# Altium schematic sheet Balancing.SchDoc
size A4; SheetNumber: 5; SheetTotal: 5
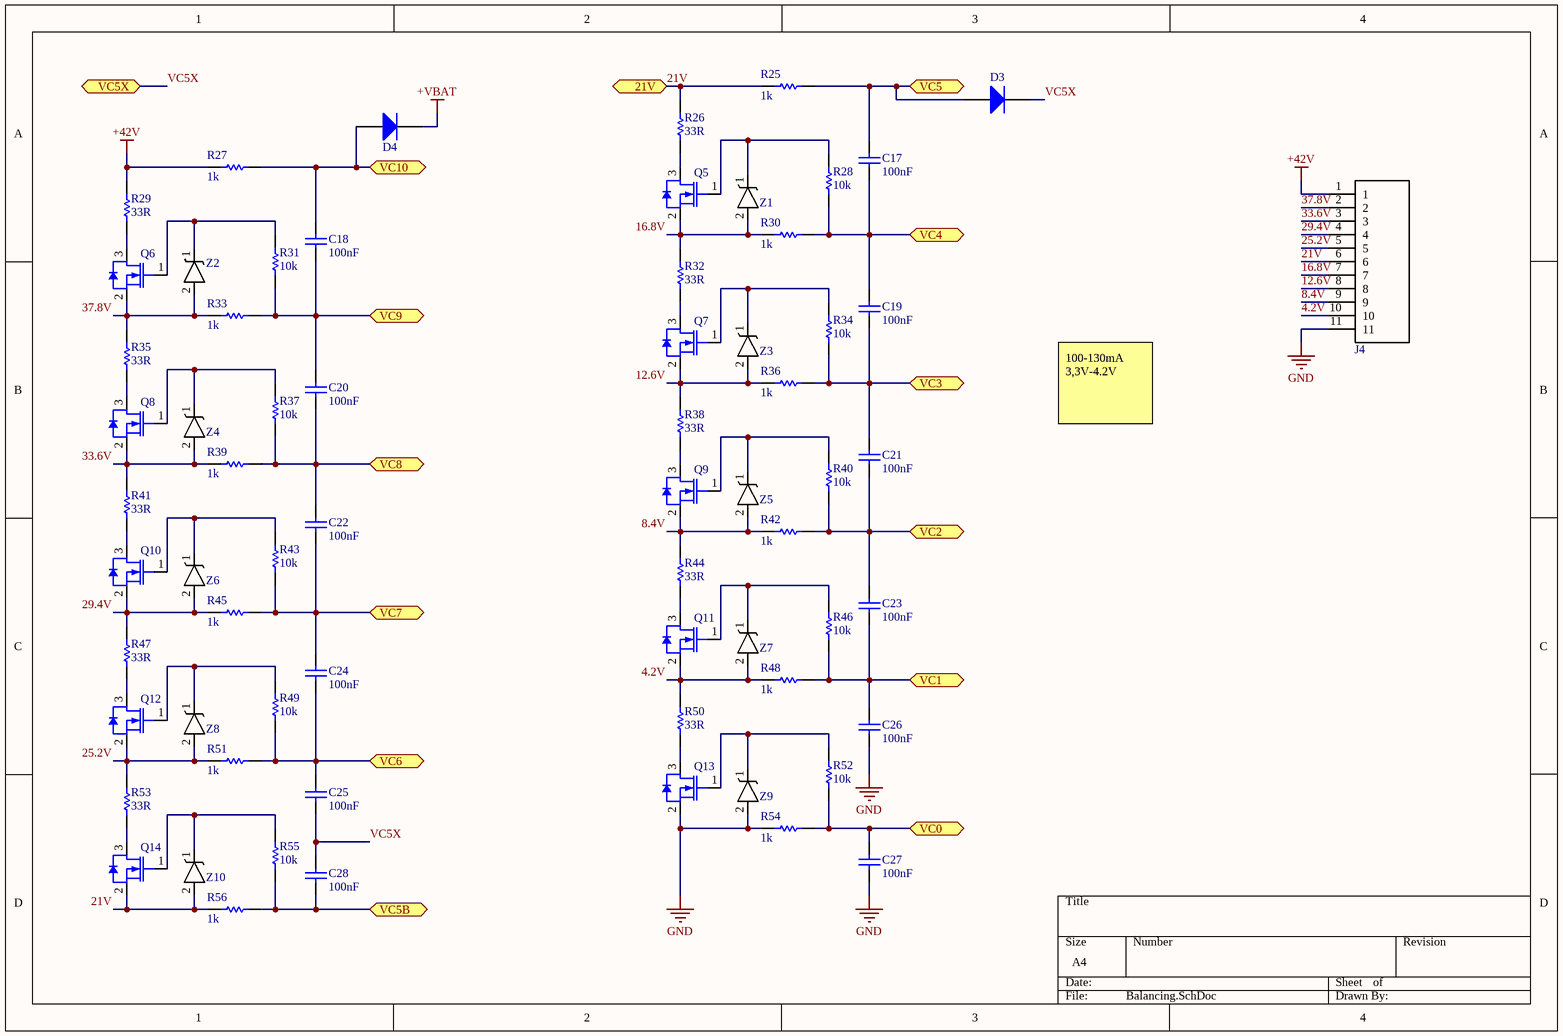
[diagram p0: Balancing.SchDoc]

## Parts
C17  value 100nF  [Wurth 0603 capacitor]  (hidden comment: Generic Capacitor 100nF 0603)
C18  value 100nF  [Wurth 0603 capacitor]  (hidden comment: Generic Capacitor 100nF 0603)
C19  value 100nF  [Wurth 0603 capacitor]  (hidden comment: Generic Capacitor 100nF 0603)
C20  value 100nF  [Wurth 0603 capacitor]  (hidden comment: Generic Capacitor 100nF 0603)
C21  value 100nF  [Wurth 0603 capacitor]  (hidden comment: Generic Capacitor 100nF 0603)
C22  value 100nF  [Wurth 0603 capacitor]  (hidden comment: Generic Capacitor 100nF 0603)
C23  value 100nF  [Wurth 0603 capacitor]  (hidden comment: Generic Capacitor 100nF 0603)
C24  value 100nF  [Wurth 0603 capacitor]  (hidden comment: Generic Capacitor 100nF 0603)
C25  value 100nF  [Wurth 0603 capacitor]  (hidden comment: Generic Capacitor 100nF 0603)
C26  value 100nF  [Wurth 0603 capacitor]  (hidden comment: Generic Capacitor 100nF 0603)
C27  value 100nF  [Wurth 0603 capacitor]  (hidden comment: Generic Capacitor 100nF 0603)
C28  value 100nF  [Wurth 0603 capacitor]  (hidden comment: Generic Capacitor 100nF 0603)
D3  1N4148W-7-F  [DIOD-SOD123-2_V]  (value not drawn)
D4  1N4148W-7-F  [DIOD-SOD123-2_V]  (value not drawn)
J4  S11B-PH-K-S_LF__SN_  [S11BPHKSLFSN]  (value not drawn)
Q5  DMN2004K-7  [Diodes SOT23-3]  (value not drawn)
Q6  DMN2004K-7  [Diodes SOT23-3]  (value not drawn)
Q7  DMN2004K-7  [Diodes SOT23-3]  (value not drawn)
Q8  DMN2004K-7  [Diodes SOT23-3]  (value not drawn)
Q9  DMN2004K-7  [Diodes SOT23-3]  (value not drawn)
Q10  DMN2004K-7  [Diodes SOT23-3]  (value not drawn)
Q11  DMN2004K-7  [Diodes SOT23-3]  (value not drawn)
Q12  DMN2004K-7  [Diodes SOT23-3]  (value not drawn)
Q13  DMN2004K-7  [Diodes SOT23-3]  (value not drawn)
Q14  DMN2004K-7  [Diodes SOT23-3]  (value not drawn)
R25  value 1k  [Wurth 0603 Resistor]  (hidden comment: CRCW060310K0FKEA)
R26  value 33R  [FOJAN 2010 Resistor]  (hidden comment: FRC2010F33R0TS)
R27  value 1k  [Wurth 0603 Resistor]  (hidden comment: CRCW060310K0FKEA)
R28  value 10k  [Wurth 0603 Resistor]  (hidden comment: Generic Resistor 10k 0603)
R29  value 33R  [FOJAN 2010 Resistor]  (hidden comment: FRC2010F33R0TS)
R30  value 1k  [Wurth 0603 Resistor]  (hidden comment: CRCW060310K0FKEA)
R31  value 10k  [Wurth 0603 Resistor]  (hidden comment: Generic Resistor 10k 0603)
R32  value 33R  [FOJAN 2010 Resistor]  (hidden comment: FRC2010F33R0TS)
R33  value 1k  [Wurth 0603 Resistor]  (hidden comment: CRCW060310K0FKEA)
R34  value 10k  [Wurth 0603 Resistor]  (hidden comment: Generic Resistor 10k 0603)
R35  value 33R  [FOJAN 2010 Resistor]  (hidden comment: FRC2010F33R0TS)
R36  value 1k  [Wurth 0603 Resistor]  (hidden comment: CRCW060310K0FKEA)
R37  value 10k  [Wurth 0603 Resistor]  (hidden comment: Generic Resistor 10k 0603)
R38  value 33R  [FOJAN 2010 Resistor]  (hidden comment: FRC2010F33R0TS)
R39  value 1k  [Wurth 0603 Resistor]  (hidden comment: CRCW060310K0FKEA)
R40  value 10k  [Wurth 0603 Resistor]  (hidden comment: Generic Resistor 10k 0603)
R41  value 33R  [FOJAN 2010 Resistor]  (hidden comment: FRC2010F33R0TS)
R42  value 1k  [Wurth 0603 Resistor]  (hidden comment: CRCW060310K0FKEA)
R43  value 10k  [Wurth 0603 Resistor]  (hidden comment: Generic Resistor 10k 0603)
R44  value 33R  [FOJAN 2010 Resistor]  (hidden comment: FRC2010F33R0TS)
R45  value 1k  [Wurth 0603 Resistor]  (hidden comment: CRCW060310K0FKEA)
R46  value 10k  [Wurth 0603 Resistor]  (hidden comment: Generic Resistor 10k 0603)
R47  value 33R  [FOJAN 2010 Resistor]  (hidden comment: FRC2010F33R0TS)
R48  value 1k  [Wurth 0603 Resistor]  (hidden comment: CRCW060310K0FKEA)
R49  value 10k  [Wurth 0603 Resistor]  (hidden comment: Generic Resistor 10k 0603)
R50  value 33R  [FOJAN 2010 Resistor]  (hidden comment: FRC2010F33R0TS)
R51  value 1k  [Wurth 0603 Resistor]  (hidden comment: CRCW060310K0FKEA)
R52  value 10k  [Wurth 0603 Resistor]  (hidden comment: Generic Resistor 10k 0603)
R53  value 33R  [FOJAN 2010 Resistor]  (hidden comment: FRC2010F33R0TS)
R54  value 1k  [Wurth 0603 Resistor]  (hidden comment: CRCW060310K0FKEA)
R55  value 10k  [Wurth 0603 Resistor]  (hidden comment: Generic Resistor 10k 0603)
R56  value 1k  [Wurth 0603 Resistor]  (hidden comment: CRCW060310K0FKEA)
Z1  MMSZ5232BS-7-F  [Diodes SOD-323]  (value not drawn)
Z2  MMSZ5232BS-7-F  [Diodes SOD-323]  (value not drawn)
Z3  MMSZ5232BS-7-F  [Diodes SOD-323]  (value not drawn)
Z4  MMSZ5232BS-7-F  [Diodes SOD-323]  (value not drawn)
Z5  MMSZ5232BS-7-F  [Diodes SOD-323]  (value not drawn)
Z6  MMSZ5232BS-7-F  [Diodes SOD-323]  (value not drawn)
Z7  MMSZ5232BS-7-F  [Diodes SOD-323]  (value not drawn)
Z8  MMSZ5232BS-7-F  [Diodes SOD-323]  (value not drawn)
Z9  MMSZ5232BS-7-F  [Diodes SOD-323]  (value not drawn)
Z10  MMSZ5232BS-7-F  [Diodes SOD-323]  (value not drawn)

## Ports
21V (bidir), VC0 (bidir), VC1 (bidir), VC2 (bidir), VC3 (bidir), VC4 (bidir), VC5 (bidir), VC5B (bidir), VC5X (bidir), VC6 (bidir), VC7 (bidir), VC8 (bidir), VC9 (bidir), VC10 (bidir)

## Nets
+42V: J4.1 R27.2 R29.2
+VBAT: D4.2(K)
GND: C26.1 C27.1 J4.11 Q13.2(S) R54.2 Z9.2(A)
4.2V: J4.10 Q11.2(S) R48.2 R50.2 Z7.2(A)
8.4V: J4.9 Q9.2(S) R42.2 R44.2 Z5.2(A)
12.6V: J4.8 Q7.2(S) R36.2 R38.2 Z3.2(A)
16.8V: J4.7 Q5.2(S) R30.2 R32.2 Z1.2(A)
21V: J4.6 Q14.2(S) R25.2 R26.2 R56.2 Z10.2(A) ; port 21V
25.2V: J4.5 Q12.2(S) R51.2 R53.2 Z8.2(A)
29.4V: J4.4 Q10.2(S) R45.2 R47.2 Z6.2(A)
33.6V: J4.3 Q8.2(S) R39.2 R41.2 Z4.2(A)
37.8V: J4.2 Q6.2(S) R33.2 R35.2 Z2.2(A)
VC0: C27.2 R52.1 R54.1 ; port VC0
VC1: C23.1 C26.2 R46.1 R48.1 ; port VC1
VC2: C21.1 C23.2 R40.1 R42.1 ; port VC2
VC3: C19.1 C21.2 R34.1 R36.1 ; port VC3
VC4: C17.1 C19.2 R28.1 R30.1 ; port VC4
VC5: C17.2 D3.1(A) R25.1 ; port VC5
VC5B: C28.1 R55.1 R56.1 ; port VC5B
VC5X: C25.1 C28.2 D3.2(K) ; port VC5X
VC6: C24.1 C25.2 R49.1 R51.1 ; port VC6
VC7: C22.1 C24.2 R43.1 R45.1 ; port VC7
VC8: C20.1 C22.2 R37.1 R39.1 ; port VC8
VC9: C18.1 C20.2 R31.1 R33.1 ; port VC9
VC10: C18.2 D4.1(A) R27.1 ; port VC10
NetQ5_1: Q5.1(G) R28.2 Z1.1(K)
NetQ5_3: Q5.3(D) R26.1
NetQ6_1: Q6.1(G) R31.2 Z2.1(K)
NetQ6_3: Q6.3(D) R29.1
NetQ7_1: Q7.1(G) R34.2 Z3.1(K)
NetQ7_3: Q7.3(D) R32.1
NetQ8_1: Q8.1(G) R37.2 Z4.1(K)
NetQ8_3: Q8.3(D) R35.1
NetQ9_1: Q9.1(G) R40.2 Z5.1(K)
NetQ9_3: Q9.3(D) R38.1
NetQ10_1: Q10.1(G) R43.2 Z6.1(K)
NetQ10_3: Q10.3(D) R41.1
NetQ11_1: Q11.1(G) R46.2 Z7.1(K)
NetQ11_3: Q11.3(D) R44.1
NetQ12_1: Q12.1(G) R49.2 Z8.1(K)
NetQ12_3: Q12.3(D) R47.1
NetQ13_1: Q13.1(G) R52.2 Z9.1(K)
NetQ13_3: Q13.3(D) R50.1
NetQ14_1: Q14.1(G) R55.2 Z10.1(K)
NetQ14_3: Q14.3(D) R53.1

## Notes on the sheet
- 100-130mA 3,3V-4.2V

## Library data of the parts
D3 D4 = CMP-2000-04932-2: Fast Switching Diode, 100 V, 0.15 A, -65 to 150 degC, 2-Pin?SOD123, RoHS, Tape and Reel; Recovery Time: 4ns; Brand: DiodesIncorporated; Unit Weight: 0.000353oz; Max Surge Current: 2A; Peak Reverse Voltage: 100V; Ir - Reverse Current: 1uA; Vf - Forward Voltage: 1.25V; Configuration: Single; If - Forward Current: 0.15A; Product Category: Diodes-GeneralPurpose,Power,Switching; Operating Temperature Range: -65Cto+150C; Packaging: Reel; Manufacturer URL: http://www.diodes.com/; Maximum Operating Temperature: +150C; Height: 1.25mm; Minimum Operating Temperature: -65C; Product: SwitchingDiodes; Package URL: http://www.diodes.com/datasheets/ds18004.pdf; Type: SwitchingDiode; Package Reference: SOD123-2; Width: 1.7mm; Datasheet URL: http://www.farnell.com/datasheets/1915529.pdf; Datasheet Version: Rev. 24-2, 10/2013; Series: 1N4148; Factory Pack Quantity: 3000; Length: 2.85mm; RoHS: True; Manufacturer: DiodesIncorporated; Mounting Style: SMD/SMT; Package / Case: SOD-123
J4 = S11B-PH-K-S_LF__SN_: Connector; Manufacturer_Name: JST (JAPAN SOLDERLESS TERMINALS); Manufacturer_Part_Number: S11B-PH-K-S(LF)(SN); Datasheet Link: http://www.farnell.com/datasheets/2057211.pdf; Height: 4.8mm; Arrow Part Number: S11B-PH-K-S(LF)(SN); Arrow Price/Stock: https://www.arrow.com/en/products/s11b-ph-k-s-lf-sn/jst-manufacturing
Q5-Q14 = Diodes DMN2004K-7: MOSFET N-CH 20V 0.63A SOT23-3; Manufacturer: Diodes Inc.; Drain To Source Resistance: 0.4Ω; Turn Off Delay Time: 59.4ns; Continuous Drain Current: 630mA; Pulse Drain Current: 1.5A; Gate To Source Voltage: 8V; Reverse Recovery Time: 5.5ns; Number Of N Channels: 1; Depletion Mode: False; Max Forward Diode Voltage: 1V; Threshold Vgs Min: 0.5V; Turn On Delay Time: 5.7ns; Standoff Height: 0.013mm; Input Capacitace At Vds: 150pF @ 16V; Rthja Max: 357°C/W; Reverse Recovery Charge: 0.85nC; Automotive Grade: Grade 0; Max Junction Temp: +150°C; Power Dissipation: 350mW; Gate Charge At Vgs: 0.9nC @ 4.5V; Octopart: https://octopart.com/dmn2004k-7-diodes+inc.-7127688; Mouser Description: MOSFET 20V 540mA; Lead Free: Yes; Footprint Url: https://www.diodes.com/assets/Package-Files/SOT23.pdf; Height: 1.1mm; Temperature: -65°C to +150°C; Device Class L2: Transistors; Device Class L1: Discrete Semiconductors; ComponentLink2Description: Datasheet; RoHS: TRUE; Device Class L3: MOSFETs; Manufacturer Part Number: DMN2004K-7; Threshold Vgs Max: 1V; Number Of Channels: 1; Automotive: Yes; Category: Trans; Temperature Range Low: -65°C; Drain To Source Voltage: 20V; Drain To Source Breakdown Voltage: 20V; ComponentLink2URL: https://www.diodes.com/assets/Datasheets/ds30938.pdf; Temperature Range High: +150°C; Package: SOT23; Digikey Description: MOSFET N-CH 20V 0.63A SOT23-3
R25 R27 R30 R33 R36 R39 R42 R45 R48 R51 R54 R56 = Generic Resistor 1k 0603
R26 R29 R32 R35 R38 R41 R44 R47 R50 R53 = FOJAN FRC2010F33R0TS: 33ohm ±1% 200V ±100ppm/℃ , 750mW, 1010; Manufacturer: Fojan
Z1-Z10 = Diodes MMSZ5232BS-7-F: Zener Diode; Manufacturer_Name: Diodes Incorporated; Datasheet Link: https://www.diodes.com/assets/Datasheets/ds31038.pdf; Height: 1.2mm; Manufacturer_Part_Number: MMSZ5232BS-7-F; Mouser Part Number: 621-MMSZ5232BS-F; Mouser Price/Stock: https://www.mouser.co.uk/ProductDetail/Diodes-Incorporated/MMSZ5232BS-7-F?qs=4u4ada%252BXaA6tF4wEjgPe2w%3D%3D; Arrow Part Number: MMSZ5232BS-7-F; Arrow Price/Stock: https://www.arrow.com/en/products/mmsz5232bs-7-f/diodes-incorporated?region=nac